# Altium schematic sheet [02] - MCU.SchDoc
size A
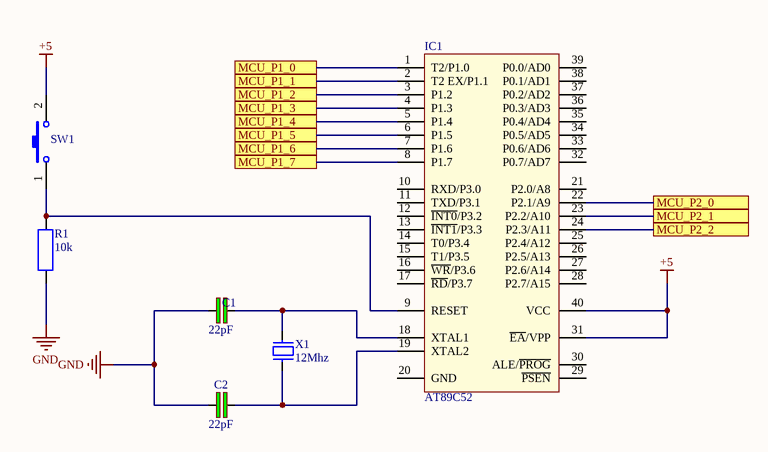
[diagram p0: [02] - MCU.SchDoc]

## Parts
C1  22pF  [CAP_0805]
C2  22pF  [CAP_0805]
IC1  AT89C52  [DIP40/W0.6]
R1  10k  [RES_SMD_0805]
SW1  SW-2P-S  [SW-2P-S]  (value not drawn)
X1  12Mhz  [XT2]

## Ports
MCU_P1_0, MCU_P1_1, MCU_P1_2, MCU_P1_3, MCU_P1_4, MCU_P1_5, MCU_P1_6, MCU_P1_7, MCU_P2_0, MCU_P2_1, MCU_P2_2

## Nets
+5: IC1.31(~{EA}/VPP) IC1.40(VCC) SW1.2
GND: C1.1 C2.1 R1.1
MCU_P1_0: IC1.1(T2/P1.0) ; port MCU_P1_0
MCU_P1_1: IC1.2(T2_EX/P1.1) ; port MCU_P1_1
MCU_P1_2: IC1.3(P1.2) ; port MCU_P1_2
MCU_P1_3: IC1.4(P1.3) ; port MCU_P1_3
MCU_P1_4: IC1.5(P1.4) ; port MCU_P1_4
MCU_P1_5: IC1.6(P1.5) ; port MCU_P1_5
MCU_P1_6: IC1.7(P1.6) ; port MCU_P1_6
MCU_P1_7: IC1.8(P1.7) ; port MCU_P1_7
MCU_P2_0: IC1.22(P2.1/A9) ; port MCU_P2_0
MCU_P2_1: IC1.23(P2.2/A10) ; port MCU_P2_1
MCU_P2_2: IC1.24(P2.3/A11) ; port MCU_P2_2
NetC1_2: C1.2 IC1.18(XTAL1) X1.2
NetC2_2: C2.2 IC1.19(XTAL2) X1.1
NetIC1_9: IC1.9(RESET) R1.2 SW1.1

Not connected (* = marked no-connect by the designer): IC1 10(RXD/P3.0) 11(TXD/P3.1) 12(~{INT0}/P3.2) 13(~{INT1}/P3.3) 14(T0/P3.4) 15(T1/P3.5) 16(~{WR}/P3.6) 17(~{RD}/P3.7) 20(GND) 21(P2.0/A8) 25(P2.4/A12) 26(P2.5/A13) 27(P2.6/A14) 28(P2.7/A15) 29(~{PSEN}) 30(ALE/~{PROG}) 32(P0.7/AD7) 33(P0.6/AD6) 34(P0.5/AD5) 35(P0.4/AD4) 36(P0.3/AD3) 37(P0.2/AD2) 38(P0.1/AD1) 39(P0.0/AD0)

## Library data of the parts
C1 C2 = C: Cap SMD; Value: 103
IC1 = AT89C52: Atmel AT89C52, 8k Byte Flash Memory , 40 Pin; Value: AT89C52
R1 = R1W: Resistor 1W; Value: R1W - 100
SW1 = SW-2PIN-SMALL: Switch Small 2 Pin; Published: 24-Mar-1999; LatestRevisionDate: 17-Jul-2002; LatestRevisionNote: Re-released for DXP Platform.; PackageReference: SPST-2; Publisher: Altium Limited
X1 = XT2: Crystal For all Crystal 2pin.; Value: 4Mhz